# EAGLE design attiny45 (EAGLE 6.5.0)
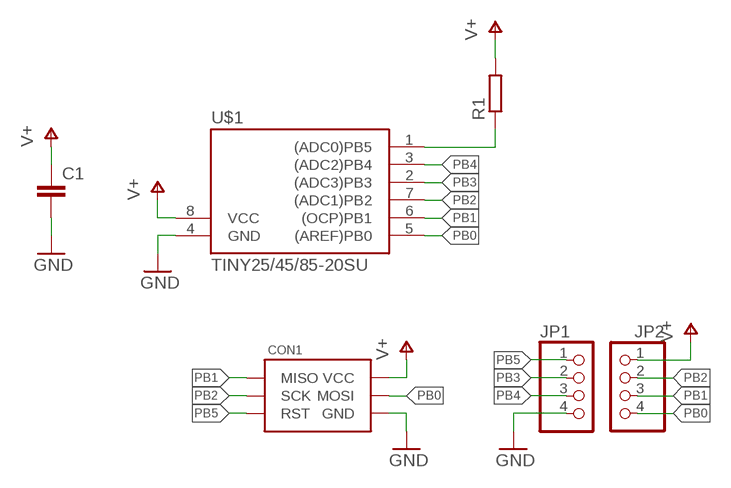
[diagram p0: schematic, sheet 1]

## Parts
C1  C-EUC0603  [C0603]
CON1  ISP-6_PIN-POGO  [POGO-1.27-6_PIN-MADWORM]
JP1  PINHD-1X4  [1X04]
JP2  PINHD-1X4  [1X04]
R1  R-EU_R0603  [R0603]
U$1  TINY25/45/85-20SU  [SOIC8]

## Nets
GND: C1.2 CON1.P$6(GND) JP1.4 U$1.4(GND)
PB0: CON1.P$4(MOSI) JP2.4 U$1.5((AREF)PB0)
PB1: CON1.P$1(MISO) JP2.3 U$1.6((OCP)PB1)
PB2: CON1.P$3(SCK) JP2.2 U$1.7((ADC1)PB2)
PB3: JP1.2 U$1.2((ADC3)PB3)
PB4: JP1.3 U$1.3((ADC2)PB4)
PB5: CON1.P$5(RST) JP1.1 R1.1 U$1.1((ADC0)PB5)
V+: C1.1 CON1.P$2(VCC) JP2.1 R1.2 U$1.8(VCC)

## Library data of the parts
C1 = p.peter-rcl:C-EU: CAPACITOR, European symbol
CON1 = p.peter-connectors:ISP-6_PIN: AVR 6 PIN ISP header Edge connector normal layout
JP1 JP2 = pinhead:PINHD-1X4: PIN HEADER
R1 = p.peter-rcl:R-EU_: RESISTOR, European symbol
U$1 = avr:TINY25/45/85

## Board
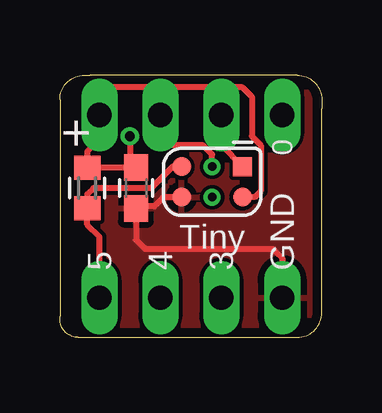
[diagram p1: board, top side]
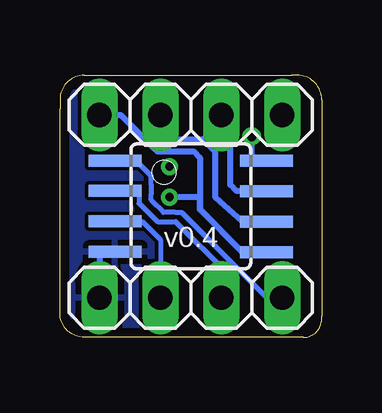
[diagram p2: board, bottom side, seen from below]

Size 10.92 x 10.92 mm. Coordinates in mm from the lower left corner, seen from the top.
Outline: 0.76,0 9.91,0 arc90 10.92,1.02 10.92,1.14 10.92,9.53 10.92,9.91 arc90 9.91,10.92 1.27,10.92 1.02,10.92 arc90 0,9.91 0,6.35 0,0.89 0,0.76 arc90 0.76,0
Copper layers (1*16): Top 0.0356mm / dielectric 1.5011mm / Bottom 0.0356mm
Design rules "oshpark": minimum track width 6mil, minimum drill 13mil, track to track 6mil, track to pad 6mil, pad to pad 6mil, via to via 6mil, smd to smd 6mil, copper to edge 15mil, drill to drill 6mil, minimum pad ring 7mil, minimum via ring 7mil, stop-mask expansion 4mil, vias tented up to drill 4.1mm, thermal gap 10mil

### Footprints (pad centres in the part's own frame; a part is rotated, then mirrored left to right if it is on the bottom)
C0603 = smd 1.1 x 1: 1 -0.85,0; 2 0.85,0
POGO-1.27-6_PIN-MADWORM = smd 0.8 x 0.8: P$1 -1.27,-0.635; P$2 -1.27,0.635; P$5 1.27,-0.635; P$6 1.27,0.635 | drill 0.35: P$3 0,-0.635; P$4 0,0.635
1X04 = drill 1.016 long: 1 -3.81,0; 2 -1.27,0; 3 1.27,0; 4 3.81,0
R0603 = smd 1 x 1.1: 1 -0.85,0; 2 0.85,0
SOIC8 = smd 0.5 x 2.2: 1 -1.905,-3.154; 2 -0.645,-3.154; 3 0.625,-3.154; 4 1.895,-3.154; 5 1.905,3.154; 6 0.635,3.154; 7 -0.635,3.154; 8 -1.905,3.154

### Placement (x,y rotation side)
C1  3.17,6.22 270 top
CON1  6.35,6.48 180 top
JP1  5.46,1.65 180 bottom
JP2  5.46,9.27 180 bottom
R1  1.14,6.22 90 top
U$1  5.46,5.46 270 bottom

### Tracks (layer width: path | path; a pad name or v marks a point on that pad's centre or on a via)
GND
  Top 0.254: 9.27,2.03 9.27,1.91 9.27,3.3 9.02,3.56 | 8.89,3.68 9.02,3.56 | C1.2 3.17,4.06 3.56,3.68 8.89,3.68 | 8.89,3.68 9.02,3.56 | 3.34,5.21 C1.2 | CON1.P$6 4.32,5.84 4.06,5.59 3.94,5.46 3.26,5.46 C1.2
  Bottom 0.254: U$1.4 9.26,3.57 | 9.26,3.57 9.27,3.56 JP1.4 | 9.26,3.57 8.77,3.57 8.64,3.43 8.76,3.43 8.89,3.56
  pour Top: 0,0 0,10.92 10.92,10.92 10.92,0
  pour Bottom: 0,-0.13 0,10.92 10.92,10.92 10.92,-0.13
PB0
  Bottom 0.254: JP2.4 8.38,9.27 7.37,8.25 6.99,7.87 6.86,7.75 5.33,7.75 5.08,7.49 5.08,5.84 | 5.08,5.84 5.08,5.33 | 5.08,5.33 3.3,3.56 2.92,3.56 U$1.5 | 5.08,5.33 5.08,5.84 | 5.08,5.84 CON1.P$4
PB1
  Top 0.254: CON1.P$1 6.73,8 JP2.3
  Bottom 0.254: JP2.3 6.73,8.51 6.6,8.38 6.48,8.25 4.95,8.25 4.45,7.75 4.45,5.84 3.3,4.83 3.05,4.83 2.92,4.83 2.79,4.83 U$1.6
PB2
  Top 0.254: CON1.P$3 6.35,7.62 5.97,8 4.57,8 4.32,8.25 4.19,8.38 JP2.2
  Bottom 0.254: U$1.7 3.56,6.1 3.81,6.35 3.81,8.89 JP2.2
PB3
  Bottom 0.203: 7.88,6.11 7.63,6.11 7.62,6.1 7.62,5.59 6.86,4.83 6.1,4.83 5.84,4.57 4.19,2.92 JP1.2
  Bottom 0.254: 7.88,6.11 U$1.2
PB4
  Bottom 0.203: JP1.3 6.73,2.16 6.73,4.06 7.5,4.84 U$1.3
PB5
  Top 0.254: JP1.1 1.65,2.67 1.65,4.19 1.14,4.7 R1.1 1.14,5.97 1.4,6.22 3.81,6.22 4.45,6.86 4.7,7.11 CON1.P$5
  Bottom 0.203: 2.29,1.65 4.45,3.81 4.57,3.94 5.84,5.21 6.1,5.21 6.6,5.21 7.11,5.71 7.11,5.97 7.11,6.35 7.11,6.73 7.75,7.37
  Bottom 0.254: U$1.1 7.75,7.37 | 2.29,1.65 JP1.1
V+  (via drill 0.41)
  Top 0.254: 1.65,9.02 JP2.1 | 1.65,9.02 1.65,10.03 2.03,10.41 7.62,10.41 8,10.03 8,8.38 8.38,8 8.38,6.1 8.13,5.84 CON1.P$2 | 1.65,9.02 1.65,8.25 1.14,7.75 R1.2 C1.1 2.92,7.33 v2.92,8.38
  Bottom 0.254: U$1.8 2.79,7.37 2.92,7.37 v2.92,8.38

### Text on the board
tPlace: + | 0 | Tiny | 5 | 4 | 3 | GND
bPlace: v0.4